# Altium schematic sheet 701_PCIe-USBports.SchDoc: USB MainHub Ports
size A2; Organization: Greenfield Tech Solutions; Address1: Molendreef 33; Address2: Ossendrecht; Address3: 4641CS; Address4: The Netherlands; SheetNumber: 8; SheetTotal: 8
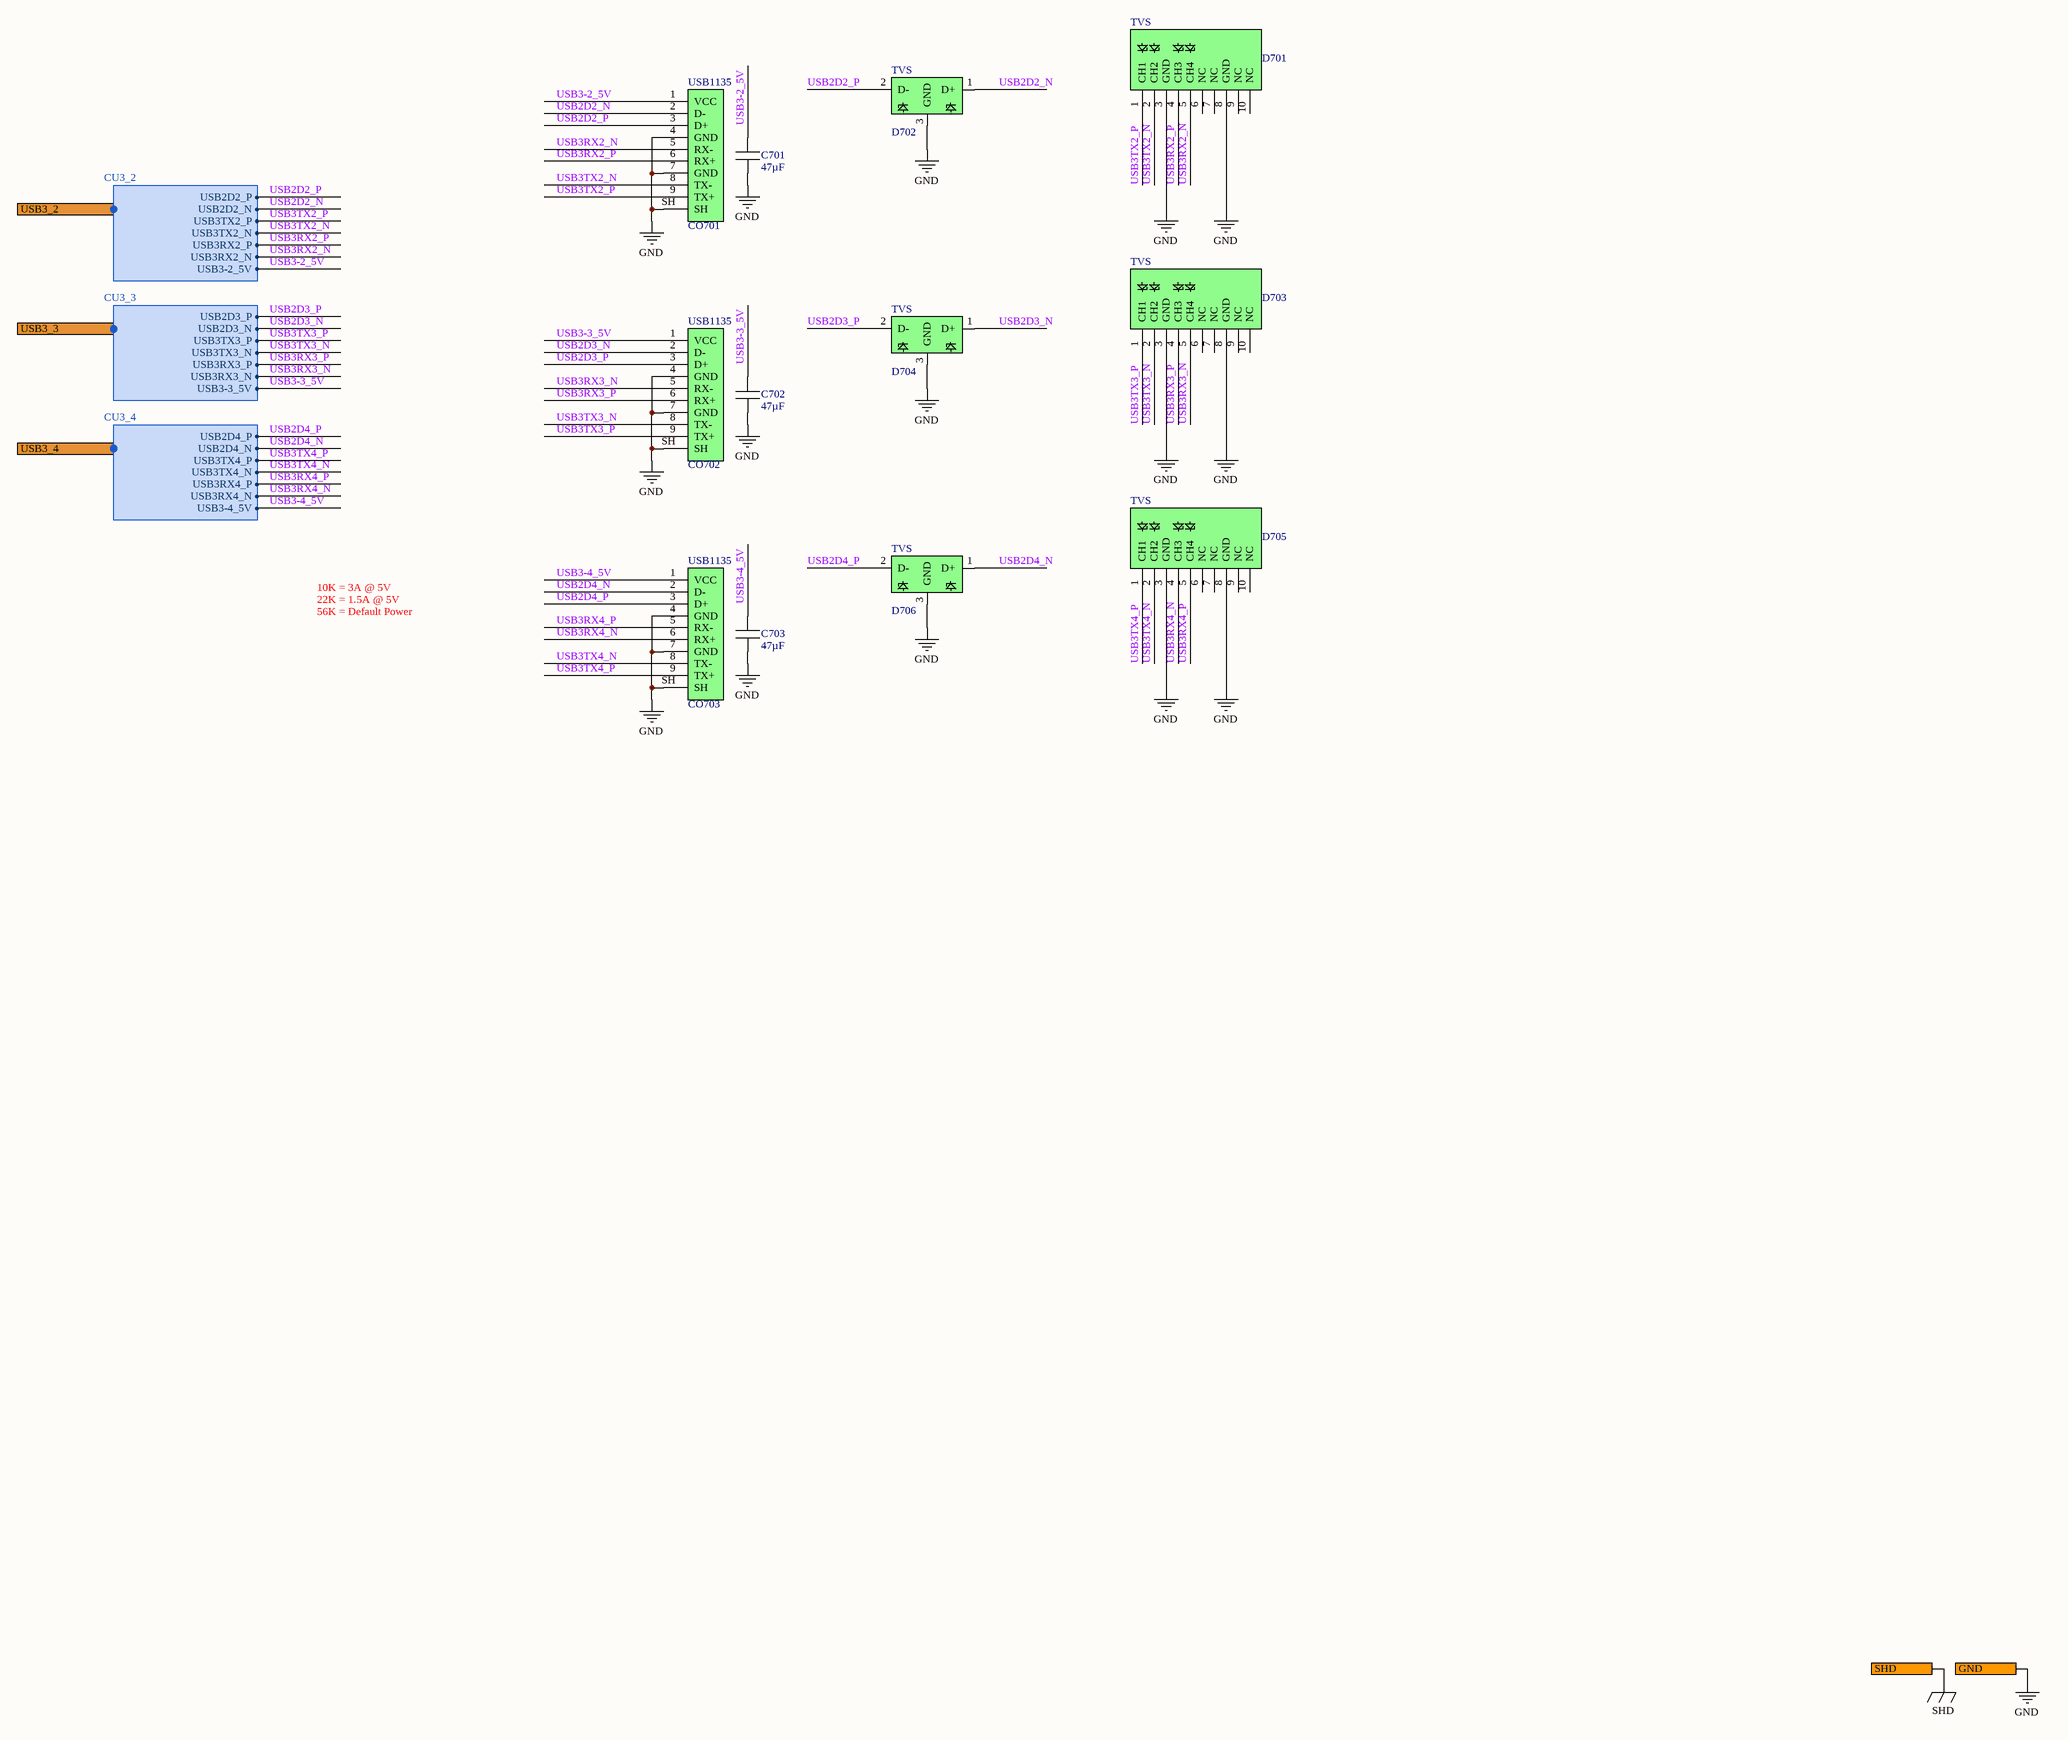
[diagram p0: 701_PCIe-USBports.SchDoc]

## Parts
C701  47µF  [C1210]
C702  47µF  [C1210]
C703  47µF  [C1210]
CO701  USB1135  [USB1135-15-9-L-B]
CO702  USB1135  [USB1135-15-9-L-B]
CO703  USB1135  [USB1135-15-9-L-B]
D701  TVS  [SOT-1176-1]
D702  TVS  [SOT-3]
D703  TVS  [SOT-1176-1]
D704  TVS  [SOT-3]
D705  TVS  [SOT-1176-1]
D706  TVS  [SOT-3]

## Ports
GND, SHD, USB3_2 (harness CU3_2), USB3_3 (harness CU3_3), USB3_4 (harness CU3_4)

## Harnesses
CU3_2: USB2D2_N, USB2D2_P, USB3TX2_N, USB3TX2_P, USB3RX2_N, USB3RX2_P, USB3-2_5V
CU3_3: USB2D3_N, USB2D3_P, USB3TX3_N, USB3TX3_P, USB3RX3_N, USB3RX3_P, USB3-3_5V
CU3_4: USB2D4_N, USB2D4_P, USB3TX4_N, USB3TX4_P, USB3RX4_N, USB3RX4_P, USB3-4_5V

## Nets
GND: C701.2 C702.2 C703.2 CO701.4(GND) CO701.7(GND) CO701.SH CO702.4(GND) CO702.7(GND) CO702.SH CO703.4(GND) CO703.7(GND) CO703.SH D701.3(GND) D701.8(GND) D702.3(GND) D703.3(GND) D703.8(GND) D704.3(GND) D705.3(GND) D705.8(GND) D706.3(GND) ; port GND
SHD: port SHD
USB2D2_N: CO701.2(D-) D702.1(D+) ; port USB3_2.USB2D2_N
USB2D2_P: CO701.3(D+) D702.2(D-) ; port USB3_2.USB2D2_P
USB2D3_N: CO702.2(D-) D704.1(D+) ; port USB3_3.USB2D3_N
USB2D3_P: CO702.3(D+) D704.2(D-) ; port USB3_3.USB2D3_P
USB2D4_N: CO703.2(D-) D706.1(D+) ; port USB3_4.USB2D4_N
USB2D4_P: CO703.3(D+) D706.2(D-) ; port USB3_4.USB2D4_P
USB3-2_5V: C701.1 CO701.1(VCC) ; port USB3_2.USB3-2_5V
USB3-3_5V: C702.1 CO702.1(VCC) ; port USB3_3.USB3-3_5V
USB3-4_5V: C703.1 CO703.1(VCC) ; port USB3_4.USB3-4_5V
USB3RX2_N: CO701.5(RX-) D701.5(CH4) ; port USB3_2.USB3RX2_N
USB3RX2_P: CO701.6(RX+) D701.4(CH3) ; port USB3_2.USB3RX2_P
USB3RX3_N: CO702.5(RX-) D703.5(CH4) ; port USB3_3.USB3RX3_N
USB3RX3_P: CO702.6(RX+) D703.4(CH3) ; port USB3_3.USB3RX3_P
USB3RX4_N: CO703.6(RX+) D705.4(CH3) ; port USB3_4.USB3RX4_N
USB3RX4_P: CO703.5(RX-) D705.5(CH4) ; port USB3_4.USB3RX4_P
USB3TX2_N: CO701.8(TX-) D701.2(CH2) ; port USB3_2.USB3TX2_N
USB3TX2_P: CO701.9(TX+) D701.1(CH1) ; port USB3_2.USB3TX2_P
USB3TX3_N: CO702.8(TX-) D703.2(CH2) ; port USB3_3.USB3TX3_N
USB3TX3_P: CO702.9(TX+) D703.1(CH1) ; port USB3_3.USB3TX3_P
USB3TX4_N: CO703.8(TX-) D705.2(CH2) ; port USB3_4.USB3TX4_N
USB3TX4_P: CO703.9(TX+) D705.1(CH1) ; port USB3_4.USB3TX4_P

Not connected (* = marked no-connect by the designer): D701 6(NC) 7(NC) 9(NC) 10(NC); D703 6(NC) 7(NC) 9(NC) 10(NC); D705 6(NC) 7(NC) 9(NC) 10(NC)

## Notes on the sheet
- 10K = 3A @ 5V
  22K = 1.5A @ 5V
  56K = Default Power
- Title
- Size:
- Date:
- File:
- A2
- Number:
- Time:
- Revision:
- Sheet
- of

## Library data of the parts
C701-C703 = CA0007: 47µF 16V 20% X5R; Part Number: CA0007; ManfactPart: EMK325ABJ476MM8P; ID: 7; RefVal: 47µF
CO701-CO703 = CO0041: USB3.0 Type A receptacle Horizontal; Part Number: CO0041; ID: 41; RefVal: USB1135; ManfactPart: USB1135-15-9-L-B
D701 D703 D705 = DI0007: USB 3 TVS Diode; Part Number: DI0007; ManfactPart: PUSB3FA2Z; ID: 7; RefVal: TVS
D702 D704 D706 = DI0002: USB 2 TVS Diode; Part Number: DI0002; ManfactPart: TPD2EUSB30DRTR; ID: 2; RefVal: TVS